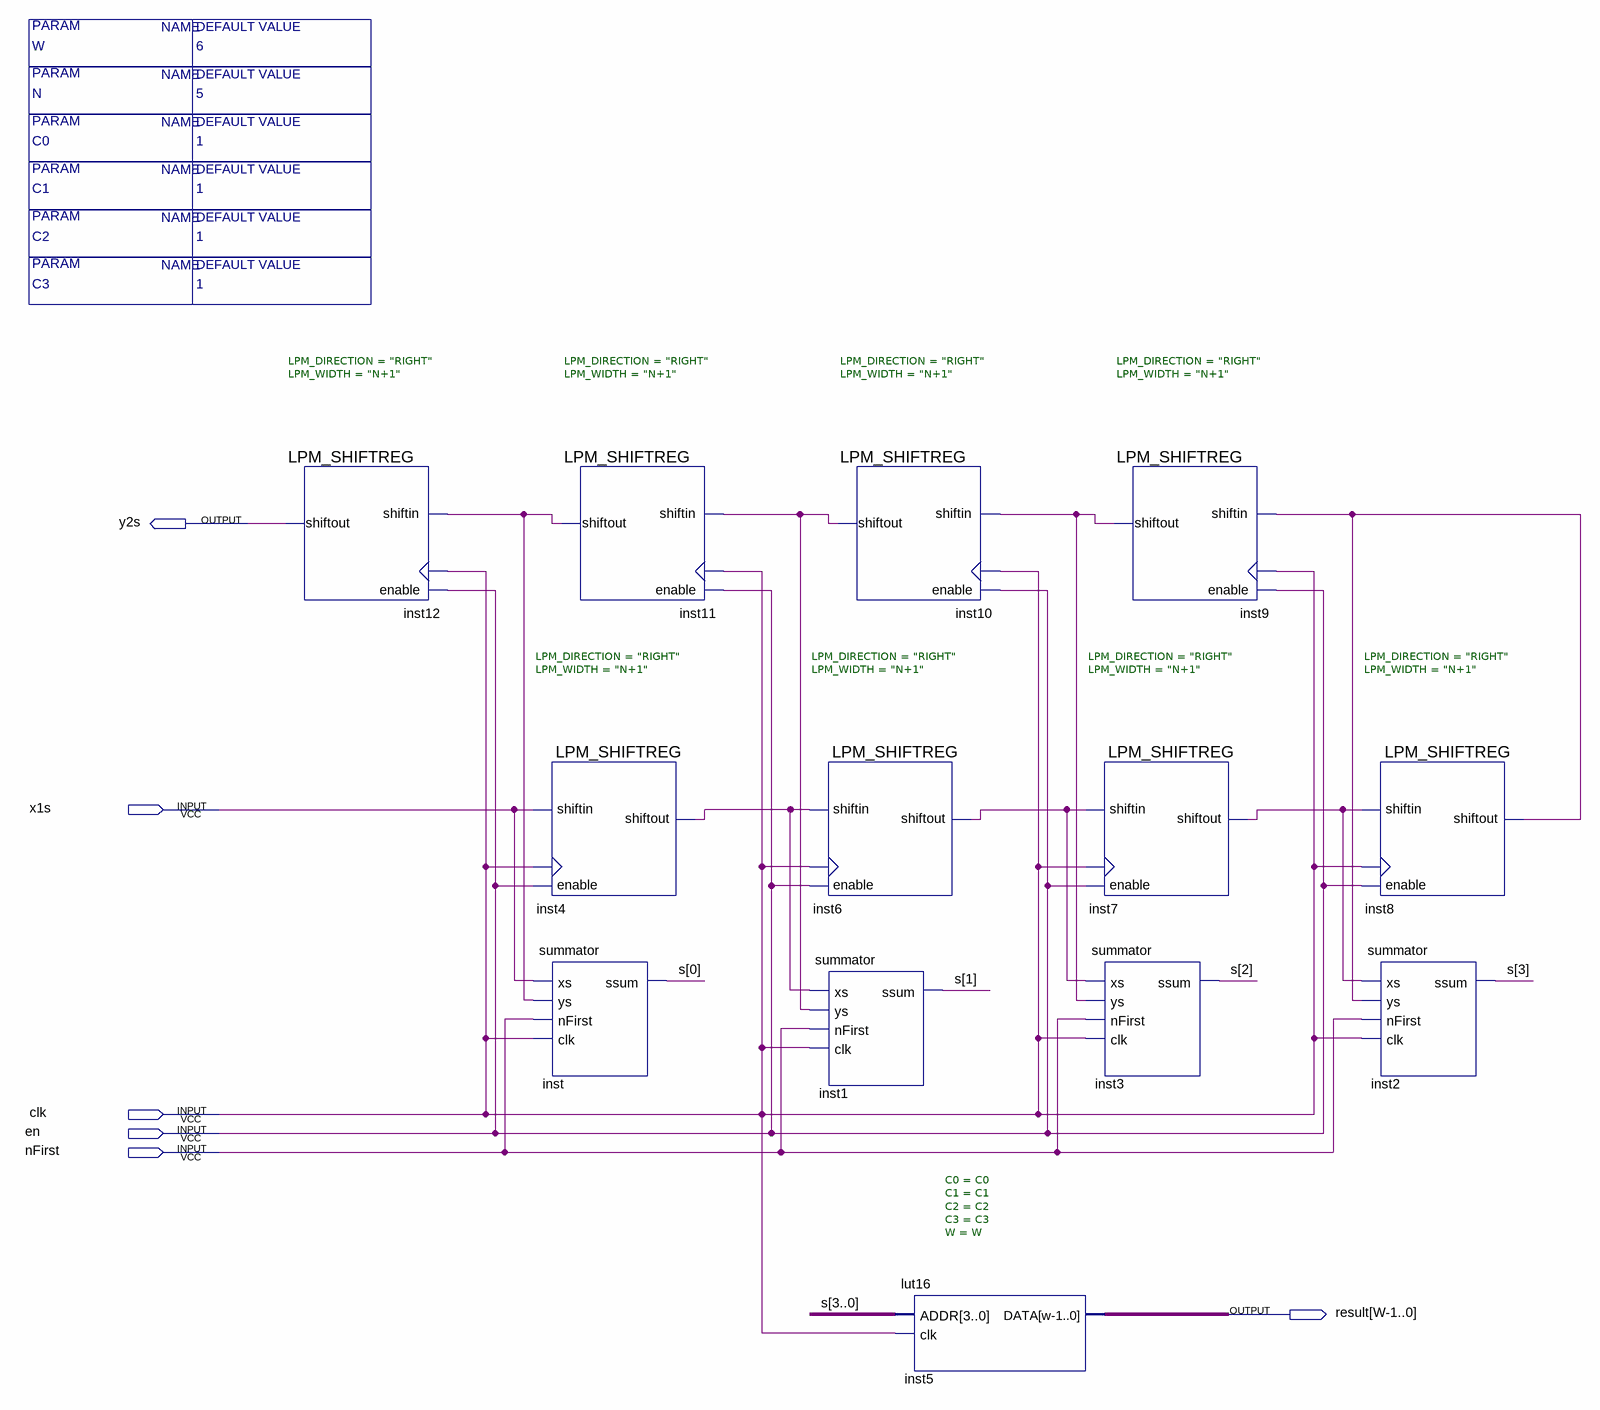
[diagram p0: schematic sheet]
// Quartus schematic 8tapfir.bdf as structural Verilog: 13 symbols, 6 pins
module \8tapfir  #(parameter W = 6, parameter C0 = 1, parameter C1 = 1, parameter C2 = 1, parameter C3 = 1, parameter N = 5) (
  input  x1s,
  input  clk,
  input  en,
  input  nFirst,
  output y2s,
  output [5:0] result
);

  wire inst4_shiftout, inst6_shiftout, inst7_shiftout, inst8_shiftout, inst9_shiftout, inst10_shiftout,
       inst11_shiftout;
  wire [3:0] s;

  LPM_SHIFTREG #(.LPM_DIRECTION("RIGHT"), .LPM_WIDTH("N+1")) inst12 (
    .shiftin(inst11_shiftout), .enable(en), .clock(clk), .shiftout(y2s));
  LPM_SHIFTREG #(.LPM_DIRECTION("RIGHT"), .LPM_WIDTH("N+1")) inst11 (
    .shiftin(inst10_shiftout), .enable(en), .clock(clk), .shiftout(inst11_shiftout));
  LPM_SHIFTREG #(.LPM_DIRECTION("RIGHT"), .LPM_WIDTH("N+1")) inst4 (
    .shiftin(x1s), .enable(en), .clock(clk), .shiftout(inst4_shiftout));
  summator inst (.xs(x1s), .ys(inst11_shiftout), .nFirst(nFirst), .clk(clk), .ssum(s[0]));
  LPM_SHIFTREG #(.LPM_DIRECTION("RIGHT"), .LPM_WIDTH("N+1")) inst6 (
    .shiftin(inst4_shiftout), .enable(en), .clock(clk), .shiftout(inst6_shiftout));
  summator inst1 (.xs(inst4_shiftout), .ys(inst10_shiftout), .nFirst(nFirst), .clk(clk), .ssum(s[1]));
  LPM_SHIFTREG #(.LPM_DIRECTION("RIGHT"), .LPM_WIDTH("N+1")) inst10 (
    .shiftin(inst9_shiftout), .enable(en), .clock(clk), .shiftout(inst10_shiftout));
  lut16 #(.C0(C0), .C1(C1), .C2(C2), .C3(C3), .W(W)) inst5 (.ADDR(s), .clk(clk), .DATA(result));
  LPM_SHIFTREG #(.LPM_DIRECTION("RIGHT"), .LPM_WIDTH("N+1")) inst9 (
    .shiftin(inst8_shiftout), .enable(en), .clock(clk), .shiftout(inst9_shiftout));
  LPM_SHIFTREG #(.LPM_DIRECTION("RIGHT"), .LPM_WIDTH("N+1")) inst7 (
    .shiftin(inst6_shiftout), .enable(en), .clock(clk), .shiftout(inst7_shiftout));
  summator inst3 (.xs(inst6_shiftout), .ys(inst9_shiftout), .nFirst(nFirst), .clk(clk), .ssum(s[2]));
  LPM_SHIFTREG #(.LPM_DIRECTION("RIGHT"), .LPM_WIDTH("N+1")) inst8 (
    .shiftin(inst7_shiftout), .enable(en), .clock(clk), .shiftout(inst8_shiftout));
  summator inst2 (.xs(inst7_shiftout), .ys(inst8_shiftout), .nFirst(nFirst), .clk(clk), .ssum(s[3]));
endmodule
